# Altium schematic sheet Main_Ctr_SCH.SchDoc
size A3
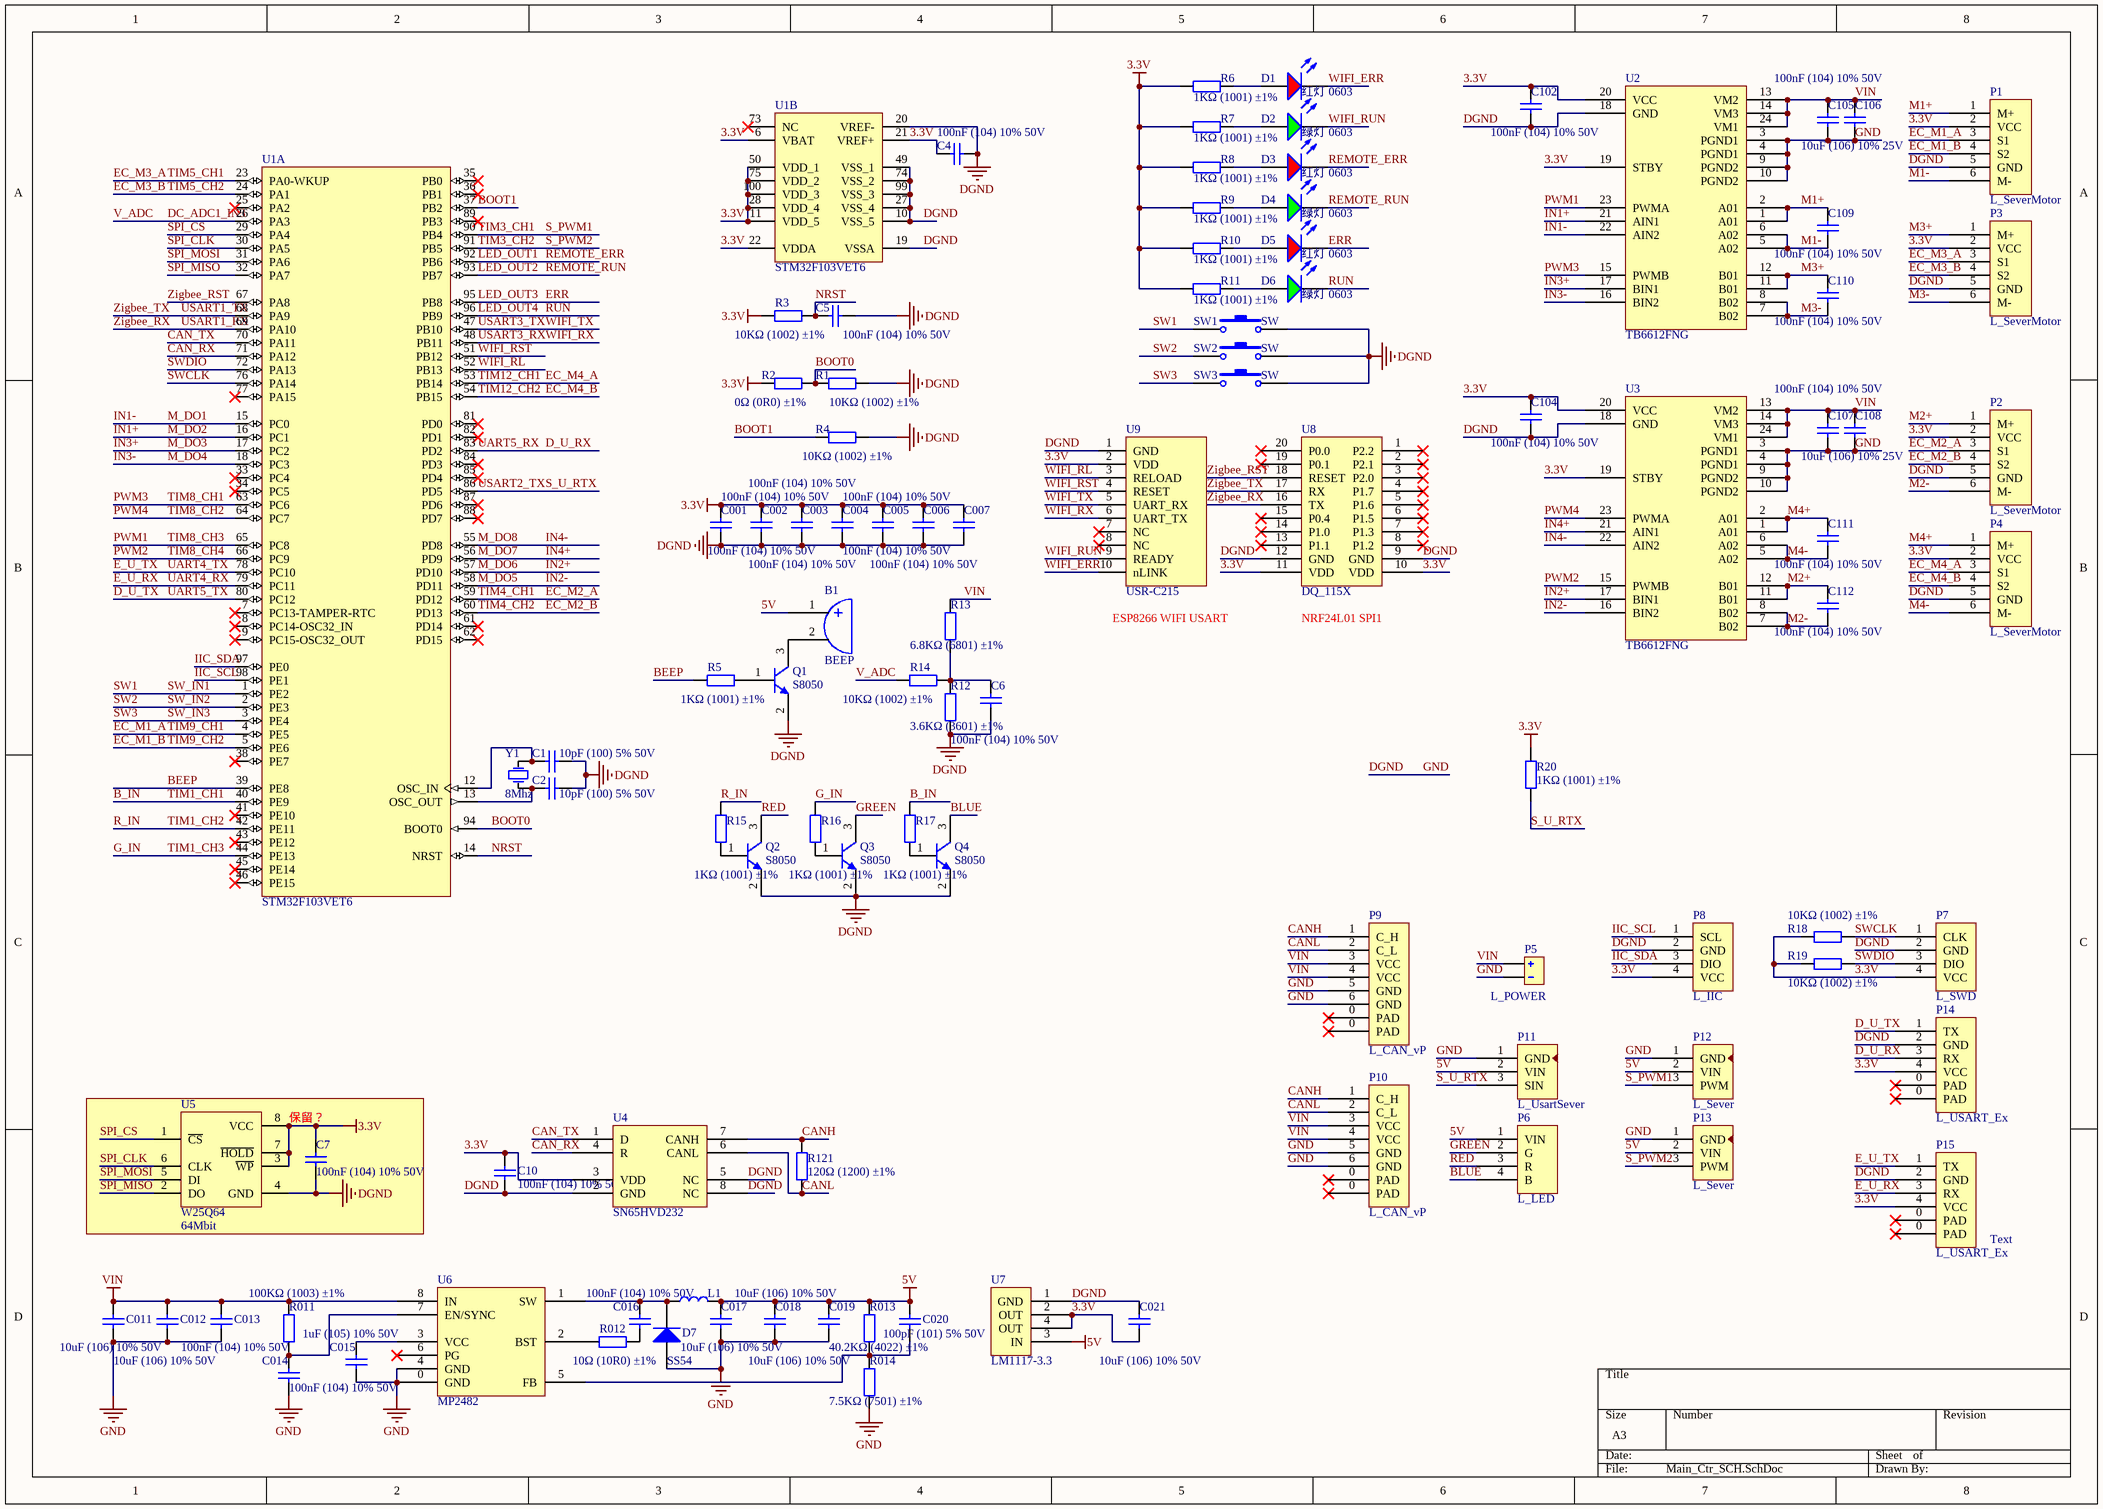
[diagram p0: Main_Ctr_SCH.SchDoc]

## Parts
B1  BEEP  [BEEP_0905]
C1  10pF (100) 5% 50V  [0603_C]
C001  100nF (104) 10% 50V  [0603_C]
C2  10pF (100) 5% 50V  [0603_C]
C002  100nF (104) 10% 50V  [0603_C]
C003  100nF (104) 10% 50V  [0603_C]
C4  100nF (104) 10% 50V  [0603_C]
C004  100nF (104) 10% 50V  [0603_C]
C5  100nF (104) 10% 50V  [0603_C]
C005  100nF (104) 10% 50V  [0603_C]
C006  100nF (104) 10% 50V  [0603_C]
C6  100nF (104) 10% 50V  [0603_C]
C007  100nF (104) 10% 50V  [0603_C]
C7  100nF (104) 10% 50V  [0603_C]
C10  100nF (104) 10% 50V  [0603_C]
C011  10uF (106) 10% 50V  [1206_C]
C012  10uF (106) 10% 50V  [1206_C]
C013  100nF (104) 10% 50V  [0603_C]
C014  100nF (104) 10% 50V  [0603_C]
C015  1uF (105) 10% 50V  [0603_C]
C016  100nF (104) 10% 50V  [0603_C]
C017  10uF (106) 10% 50V  [1206_C]
C018  10uF (106) 10% 50V  [1206_C]
C019  10uF (106) 10% 50V  [1206_C]
C020  100pF (101) 5% 50V  [0603_C]
C021  10uF (106) 10% 50V  [1206_C]
C102  100nF (104) 10% 50V  [0603_C]
C104  100nF (104) 10% 50V  [0603_C]
C105  100nF (104) 10% 50V  [0603_C]
C106  10uF (106) 10% 25V  [0805_C]
C107  100nF (104) 10% 50V  [0603_C]
C108  10uF (106) 10% 25V  [0805_C]
C109  100nF (104) 10% 50V  [0603_C]
C110  100nF (104) 10% 50V  [0603_C]
C111  100nF (104) 10% 50V  [0603_C]
C112  100nF (104) 10% 50V  [0603_C]
D1  红灯 0603  [0603_LED_S1]
D2  绿灯 0603  [0603_LED_S1]
D3  红灯 0603  [0603_LED_S1]
D4  绿灯 0603  [0603_LED_S1]
D5  红灯 0603  [0603_LED_S1]
D6  绿灯 0603  [0603_LED_S1]
D7  SS54  [SMA(DO-214AC)_S1]
L1  Inductor  [1810]  (value not drawn)
P1  L_SeverMotor  [PH2.0*6P]
P2  L_SeverMotor  [PH2.0*6P]
P3  L_SeverMotor  [PH2.0*6P]
P4  L_SeverMotor  [PH2.0*6P]
P5  L_POWER  [HY2.0*2P]
P6  L_LED  [SM04B-GHS-TB]
P7  L_SWD  [MOLEX-53398-0471]
P8  L_IIC  [MOLEX-53398-0471]
P9  L_CAN_vP  [BM06B-GHS-TBT]
P10  L_CAN_vP  [BM06B-GHS-TBT]
P11  L_UsartSever  [MOLEX-5267-03A]
P12  L_Sever  [HDR3X1-2.54]
P13  L_Sever  [HDR3X1-2.54]
P14  L_USART_Ex  [BM04B-GHS-TBT]
P15  L_USART_Ex  [BM04B-GHS-TBT]
Q1  S8050  [SOP23-3]
Q2  S8050  [SOP23-3]
Q3  S8050  [SOP23-3]
Q4  S8050  [SOP23-3]
R1  10KΩ (1002) ±1%  [0603_R]
R2  0Ω (0R0) ±1%  [0603_R]
R3  10KΩ (1002) ±1%  [0603_R]
R4  10KΩ (1002) ±1%  [0603_R]
R5  1KΩ (1001) ±1%  [0603_R]
R6  1KΩ (1001) ±1%  [0603_R]
R7  1KΩ (1001) ±1%  [0603_R]
R8  1KΩ (1001) ±1%  [0603_R]
R9  1KΩ (1001) ±1%  [0603_R]
R10  1KΩ (1001) ±1%  [0603_R]
R11  1KΩ (1001) ±1%  [0603_R]
R011  100KΩ (1003) ±1%  [0603_R]
R12  3.6KΩ (3601) ±1%  [0603_R]
R012  10Ω (10R0) ±1%  [0603_R]
R13  6.8KΩ (6801) ±1%  [0603_R]
R013  40.2KΩ (4022) ±1%  [0603_R]
R14  10KΩ (1002) ±1%  [0603_R]
R014  7.5KΩ (7501) ±1%  [0603_R]
R15  1KΩ (1001) ±1%  [0603_R]
R16  1KΩ (1001) ±1%  [0603_R]
R17  1KΩ (1001) ±1%  [0603_R]
R18  10KΩ (1002) ±1%  [0603_R]
R19  10KΩ (1002) ±1%  [0603_R]
R20  1KΩ (1001) ±1%  [0603_R]
R121  120Ω (1200) ±1%  [0603_R]
SW1  SW  [SW-PB2-A1]
SW2  SW  [SW-PB2-A1]
SW3  SW  [SW-PB2-A1]
U1  STM32F103VET6  [LQFP-100_14x14x05P]  (parts A,B of 2)
U2  TB6612FNG  [SSOP-24]
U3  TB6612FNG  [SSOP-24]
U4  SN65HVD232  [SOIC-8]
U5  W25Q64  value 64Mbit  [SOIC_8_W]
U6  MP2482  [SOIC-8P]
U7  LM1117-3.3  [SOT223]
U8  DQ_115X  [LW_1151]
U9  USR-C215  [USR-C215]
Y1  value 8Mhz  [5032]  (hidden comment: XTAL)

## Blocks framed on the sheet
保留？: C7 U5

## Nets
3.3V: C001.2 C002.2 C003.2 C4.2 C004.2 C005.2 C006.2 C007.2 C7.2 C10.1 C021.1 C102.2 C104.2 P1.2(VCC) P2.2(VCC) P3.2(VCC) P4.2(VCC) P7.4(VCC) P8.4(VCC) P14.4(VCC) P15.4(VCC) R2.1 R3.1 R6.1 R7.1 R8.1 R9.1 R10.1 R11.1 R18.1 R19.1 R20.2 U1.6(VBAT) U1.11(VDD_5) U1.21(VREF+) U1.22(VDDA) U1.28(VDD_4) U1.50(VDD_1) U1.75(VDD_2) U1.100(VDD_3) U2.19(STBY) U2.20(VCC) U3.19(STBY) U3.20(VCC) U4.3(VDD) U5.3(~{WP}) U5.7(~{HOLD}) U5.8(VCC) U7.2(OUT) U7.4(OUT) U8.10(VDD) U8.11(VDD) U9.2(VDD)
5V: B1.1 C017.2 C018.2 C019.2 C020.1 L1.2 P6.1(VIN) P11.2(VIN) P12.2(VIN) P13.2(VIN) R013.2 U7.3(IN)
DGND: C1.1 C001.1 C2.1 C002.1 C003.1 C4.1 C004.1 C005.1 C5.2 C006.1 C6.1 C007.1 C7.1 C10.2 C011.1 C012.1 C013.1 C014.1 C015.1 C017.1 C018.1 C019.1 C021.2 C102.1 C104.1 C105.1 C106.1 C107.1 C108.1 D7.1(A) P1.5(GND) P2.5(GND) P3.5(GND) P4.5(GND) P5.2 P7.2(GND) P8.2(GND) P9.5(GND) P9.6(GND) P10.5(GND) P10.6(GND) P11.1(GND) P12.1(GND) P13.1(GND) P14.2(GND) P15.2(GND) Q1.2(E) Q2.2(E) Q3.2(E) Q4.2(E) R1.2 R4.2 R12.1 R014.1 SW1.2 SW2.2 SW3.2 U1.10(VSS_5) U1.19(VSSA) U1.20(VREF-) U1.27(VSS_4) U1.49(VSS_1) U1.74(VSS_2) U1.99(VSS_3) U2.3(PGND1) U2.4(PGND1) U2.9(PGND2) U2.10(PGND2) U2.18(GND) U3.3(PGND1) U3.4(PGND1) U3.9(PGND2) U3.10(PGND2) U3.18(GND) U4.2(GND) U4.5(NC) U4.8(NC) U5.4(GND) U6.0(GND) U6.4(GND) U7.1(GND) U8.9(GND) U8.12(GND) U9.1(GND)  [also labelled GND]
VIN: C011.2 C012.2 C013.2 C105.2 C106.2 C107.2 C108.2 P5.1 P9.3(VCC) P9.4(VCC) P10.3(VCC) P10.4(VCC) R011.2 R13.2 U2.13(VM2) U2.14(VM3) U2.24(VM1) U3.13(VM2) U3.14(VM3) U3.24(VM1) U6.8(IN)
B_IN: R17.2 U1.40(PE9)  [also labelled TIM1_CH1]
BEEP: R5.1 U1.39(PE8)
BLUE: P6.4(B) Q4.3(C)
BOOT0: R1.1 R2.2 U1.94(BOOT0)
BOOT1: R4.1 U1.37(PB2)
CAN_RX: U1.71(PA12) U4.4(R)
CAN_TX: U1.70(PA11) U4.1(D)
CANH: P9.1(C_H) P10.1(C_H) R121.2 U4.7(CANH)
CANL: P9.2(C_L) P10.2(C_L) R121.1 U4.6(CANL)
D_U_RX: P14.3(RX) U1.83(PD2)  [also labelled UART5_RX]
D_U_TX: P14.1(TX) U1.80(PC12)  [also labelled UART5_TX]
DC_ADC1_IN3: R14.2 U1.26(PA3)  [also labelled V_ADC]
E_U_RX: P15.3(RX) U1.79(PC11)  [also labelled UART4_RX]
E_U_TX: P15.1(TX) U1.78(PC10)  [also labelled UART4_TX]
EC_M1_A: P1.3(S1) U1.4(PE5)  [also labelled TIM9_CH1]
EC_M1_B: P1.4(S2) U1.5(PE6)  [also labelled TIM9_CH2]
EC_M2_A: P2.3(S1) U1.59(PD12)  [also labelled TIM4_CH1]
EC_M2_B: P2.4(S2) U1.60(PD13)  [also labelled TIM4_CH2]
EC_M3_A: P3.3(S1) U1.23(PA0-WKUP)  [also labelled TIM5_CH1]
EC_M3_B: P3.4(S2) U1.24(PA1)  [also labelled TIM5_CH2]
EC_M4_A: P4.3(S1) U1.53(PB14)  [also labelled TIM12_CH1]
EC_M4_B: P4.4(S2) U1.54(PB15)  [also labelled TIM12_CH2]
ERR: D5.K U1.95(PB8)  [also labelled LED_OUT3]
G_IN: R16.2 U1.44(PE13)  [also labelled TIM1_CH3]
GREEN: P6.2(G) Q3.3(C)
IIC_SCL: P8.1(SCL) U1.98(PE1)
IIC_SDA: P8.3(DIO) U1.97(PE0)
IN1+: U1.16(PC1) U2.21(AIN1)  [also labelled M_DO2]
IN1-: U1.15(PC0) U2.22(AIN2)  [also labelled M_DO1]
IN2+: U1.57(PD10) U3.17(BIN1)  [also labelled M_DO6]
IN2-: U1.58(PD11) U3.16(BIN2)  [also labelled M_DO5]
IN3+: U1.17(PC2) U2.17(BIN1)  [also labelled M_DO3]
IN3-: U1.18(PC3) U2.16(BIN2)  [also labelled M_DO4]
IN4+: U1.56(PD9) U3.21(AIN1)  [also labelled M_DO7]
IN4-: U1.55(PD8) U3.22(AIN2)  [also labelled M_DO8]
LED_OUT1: D3.K U1.92(PB6)  [also labelled REMOTE_ERR]
LED_OUT2: D4.K U1.93(PB7)  [also labelled REMOTE_RUN]
LED_OUT4: D6.K U1.96(PB9)  [also labelled RUN]
M1+: C109.2 P1.1(M+) U2.1(A01) U2.2(A01)
M1-: C109.1 P1.6(M-) U2.5(A02) U2.6(A02)
M2+: C112.2 P2.1(M+) U3.11(B01) U3.12(B01)
M2-: C112.1 P2.6(M-) U3.7(B02) U3.8(B02)
M3+: C110.2 P3.1(M+) U2.11(B01) U2.12(B01)
M3-: C110.1 P3.6(M-) U2.7(B02) U2.8(B02)
M4+: C111.2 P4.1(M+) U3.1(A01) U3.2(A01)
M4-: C111.1 P4.6(M-) U3.5(A02) U3.6(A02)
NRST: C5.1 R3.2 U1.14(NRST)
PWM1: U1.65(PC8) U2.23(PWMA)  [also labelled TIM8_CH3]
PWM2: U1.66(PC9) U3.15(PWMB)  [also labelled TIM8_CH4]
PWM3: U1.63(PC6) U2.15(PWMB)  [also labelled TIM8_CH1]
PWM4: U1.64(PC7) U3.23(PWMA)  [also labelled TIM8_CH2]
R_IN: R15.2 U1.42(PE11)  [also labelled TIM1_CH2]
RED: P6.3(R) Q2.3(C)
S_PWM1: P12.3(PWM) U1.90(PB4)  [also labelled TIM3_CH1]
S_PWM2: P13.3(PWM) U1.91(PB5)  [also labelled TIM3_CH2]
S_U_RTX: P11.3(SIN) R20.1 U1.86(PD5)  [also labelled USART2_TX]
SPI_CLK: U1.30(PA5) U5.6(CLK)
SPI_CS: U1.29(PA4) U5.1(~{CS})
SPI_MISO: U1.32(PA7) U5.2(DO)
SPI_MOSI: U1.31(PA6) U5.5(DI)
SW1: SW1.1 U1.1(PE2)  [also labelled SW_IN1]
SW2: SW2.1 U1.2(PE3)  [also labelled SW_IN2]
SW3: SW3.1 U1.3(PE4)  [also labelled SW_IN3]
SWCLK: P7.1(CLK) R18.2 U1.76(PA14)
SWDIO: P7.3(DIO) R19.2 U1.72(PA13)
USART1_RX: U1.69(PA10) U8.16(TX)  [also labelled Zigbee_RX]
USART1_TX: U1.68(PA9) U8.17(RX)  [also labelled Zigbee_TX]
USART3_RX: U1.48(PB11) U9.6(UART_TX)  [also labelled WIFI_RX]
USART3_TX: U1.47(PB10) U9.5(UART_RX)  [also labelled WIFI_TX]
WIFI_ERR: D1.K U9.10(nLINK)
WIFI_RL: U1.52(PB13) U9.3(RELOAD)
WIFI_RST: U1.51(PB12) U9.4(RESET)
WIFI_RUN: D2.K U9.9(READY)
Zigbee_RST: U1.67(PA8) U8.18(RESET)
NetB1_2: B1.2 Q1.3(C)
NetC1_2: C1.2 U1.12(OSC_IN) Y1.2(OSC2)
NetC2_2: C2.2 U1.13(OSC_OUT) Y1.1(OSC1)
NetC6_2: C6.2 R12.2 R13.1 R14.1
NetC014_2: C014.2 R011.1 U6.7(EN/SYNC)
NetC015_2: C015.2 U6.3(VCC)
NetC016_1: C016.1 R012.2
NetC016_2: C016.2 D7.2(K) L1.1 U6.1(SW)
NetC020_2: C020.2 R013.1 R014.2 U6.5(FB)
NetD1_A: D1.A R6.2
NetD2_A: D2.A R7.2
NetD3_A: D3.A R8.2
NetD4_A: D4.A R9.2
NetD5_A: D5.A R10.2
NetD6_A: D6.A R11.2
NetQ1_1: Q1.1(B) R5.2
NetQ2_1: Q2.1(B) R15.1
NetQ3_1: Q3.1(B) R16.1
NetQ4_1: Q4.1(B) R17.1
NetR012_1: R012.1 U6.2(BST)

Not connected (* = marked no-connect by the designer): P9 0(PAD)*; P10 0(PAD)*; P14 0(PAD)*; P15 0(PAD)*; U1 7(PC13-TAMPER-RTC)* 8(PC14-OSC32_IN)* 9(PC15-OSC32_OUT)* 25(PA2)* 33(PC4)* 34(PC5)* 35(PB0)* 36(PB1)* 38(PE7)* 41(PE10)* 43(PE12)* 45(PE14)* 46(PE15)* 61(PD14)* 62(PD15)* 73(NC)* 77(PA15)* 81(PD0)* 82(PD1)* 84(PD3)* 85(PD4)* 87(PD6)* 88(PD7)* 89(PB3)*; U6 6(PG)*; U8 1(P2.2)* 2(P2.1)* 3(P2.0)* 4(P1.7)* 5(P1.6)* 6(P1.5)* 7(P1.3)* 8(P1.2)* 13(P1.1)* 14(P1.0)* 15(P0.4)* 19(P0.1)* 20(P0.0)*; U9 7(NC)* 8(NC)*

## Notes on the sheet
- (near U9) ESP8266 WIFI USART
- (near U8) NRF24L01 SPI1
- Text

## Library data of the parts
B1 = BEEP: 有源蜂鸣器
C1 C2 = 0603 10pF (100) 5% 50V: 贴片电容; ComponentLink1Description: 供应商链接; ComponentLink1URL: http://www.szlcsc.com/product/details_1986.html; Package: 0603; Supplier: LC; SuppliersPartNumber: C1634
C001 C002 C003 C4 C004 C5 C005 C006 C6 C007 C7 C10 C013 C014 C016 C102 C104 C105 C107 C109-C112 = 0603 100nF (104) 10% 50V: 贴片电容; ComponentLink1Description: 供应商链接; ComponentLink1URL: http://www.szlcsc.com/product/details_15331.html; Package: 0603; Supplier: LC; SuppliersPartNumber: C14663
C011 C012 C017 C018 C019 C021 = 1206 10uF (106) 10% 50V: 贴片电容; ComponentLink1Description: 供应商链接; ComponentLink1URL: http://www.szlcsc.com/product/details_14236.html; Package: 1206; Supplier: LC; SuppliersPartNumber: C13585
C015 = 0603 1uF (105) 10% 50V: 贴片电容; ComponentLink1Description: 供应商链接; ComponentLink1URL: http://www.szlcsc.com/product/details_16531.html; Package: 0603; Supplier: LC; SuppliersPartNumber: C15849
C020 = 0603 100pF (101) 5% 50V: 贴片电容; ComponentLink1Description: 供应商链接; ComponentLink1URL: http://www.szlcsc.com/product/details_15530.html; Package: 0603; Supplier: LC; SuppliersPartNumber: C14858
C106 C108 = 0805 10uF (106) 10% 25V: 贴片电容; ComponentLink1Description: 供应商链接; ComponentLink1URL: http://www.szlcsc.com/product/details_16532.html; Package: 0805; Supplier: LC; SuppliersPartNumber: C15850
D1 D3 D5 = 0603 红灯: 发光二极管; ComponentLink1Description: 供应商链接; ComponentLink1URL: http://www.szlcsc.com/product/details_2659.html; Package: 0603; Supplier: LC; SuppliersPartNumber: C2286
D2 D4 D6 = 0603 绿灯: 发光二极管; ComponentLink1Description: 供应商链接; ComponentLink1URL: http://www.szlcsc.com/product/details_73152.html; Package: 0603; Supplier: LC; SuppliersPartNumber: C72043
D7 = SMA(DO-214AC) SS54: 二极管; ComponentLink1Description: 供应商链接; ComponentLink1URL: http://www.szlcsc.com/product/details_23178.html; Package: SMA(DO-214AC); Supplier: LC; SuppliersPartNumber: C22452
L1 = Inductor: 贴片电感
P1-P4 = L_SeverMotor: 伺服直流电机
P5 = L_POWER: 电源输入
P6 = L_LED: LED灯
P7 = L_SWD: SWD调试
P8 = L_IIC: IIC屏幕
P9 P10 = L_CAN_vP: 带电源CAN接口
P11 = L_UsartSever: 串口总线舵机
P12 P13 = L_Sever: 普通舵机
P14 P15 = L_USART_Ex: 串口扩展
Q1-Q4 = S8050: 三极管
R1 R3 R4 R14 R18 R19 = 0603 10KΩ (1002) 1%: 贴片电阻; ComponentLink1Description: 供应商链接; ComponentLink1URL: http://www.szlcsc.com/product/details_26547.html; Package: 0603; Supplier: LC; SuppliersPartNumber: C25804
R2 = 0603 0Ω (0R0) 1%: 贴片电阻; ComponentLink1Description: 供应商链接; ComponentLink1URL: http://www.szlcsc.com/product/details_21903.html; Package: 0603; Supplier: LC; SuppliersPartNumber: C21189
R5-R11 R15-R17 R20 = 0603 1KΩ (1001) 1%: 贴片电阻; ComponentLink1Description: 供应商链接; ComponentLink1URL: http://www.szlcsc.com/product/details_21904.html; Package: 0603; Supplier: LC; SuppliersPartNumber: C21190
R011 = 0603 100KΩ (1003) 1%: 贴片电阻; ComponentLink1Description: 供应商链接; ComponentLink1URL: http://www.szlcsc.com/product/details_26546.html; Package: 0603; Supplier: LC; SuppliersPartNumber: C25803
R12 = 0603 3.6KΩ (3601) 1%: 贴片电阻; ComponentLink1Description: 供应商链接; ComponentLink1URL: http://www.szlcsc.com/product/details_23707.html; Package: 0603; Supplier: LC; SuppliersPartNumber: C22980
R012 = 0603 10Ω (10R0) 1%: 贴片电阻; ComponentLink1Description: 供应商链接; ComponentLink1URL: http://www.szlcsc.com/product/details_23586.html; Package: 0603; Supplier: LC; SuppliersPartNumber: C22859
R13 = 0603 6.8KΩ (6801) 1%: 贴片电阻; ComponentLink1Description: 供应商链接; ComponentLink1URL: http://www.szlcsc.com/product/details_23939.html; Package: 0603; Supplier: LC; SuppliersPartNumber: C23212
R013 = 0603 40.2KΩ (4022) 1%: 贴片电阻; ComponentLink1Description: 供应商链接; ComponentLink1URL: http://www.szlcsc.com/product/details_13081.html; Package: 0603; Supplier: LC; SuppliersPartNumber: C12447
R014 = 0603 7.5KΩ (7501) 1%: 贴片电阻; ComponentLink1Description: 供应商链接; ComponentLink1URL: http://www.szlcsc.com/product/details_23961.html; Package: 0603; Supplier: LC; SuppliersPartNumber: C23234
R121 = 0603 120Ω (1200) 1%: 贴片电阻; ComponentLink1Description: 供应商链接; ComponentLink1URL: http://www.szlcsc.com/product/details_23514.html; Package: 0603; Supplier: LC; SuppliersPartNumber: C22787
SW1-SW3 = SW: 微动开关
U1 = STM32F103VET6: ARM; ComponentLink1Description: 供应商链接; ComponentLink1URL: http://www.szlcsc.com/product/details_8800.html; Package: LQFP-100_14x14x05P; Supplier: LC; SuppliersPartNumber: C8308
U2 U3 = TB6612FNG: MotorDriver; Package: SSOP24
U4 = SN65HVD232: SOIC-8
U5 = W25Q64: SPI FLASH
U6 = MP2482: DC-DC
U7 = LM1117-3.3: 线性稳压
U8 = DQ_115X: zigbee_usart
U9 = USR-C215: WIFI
Y1 = XTAL: 无源晶振